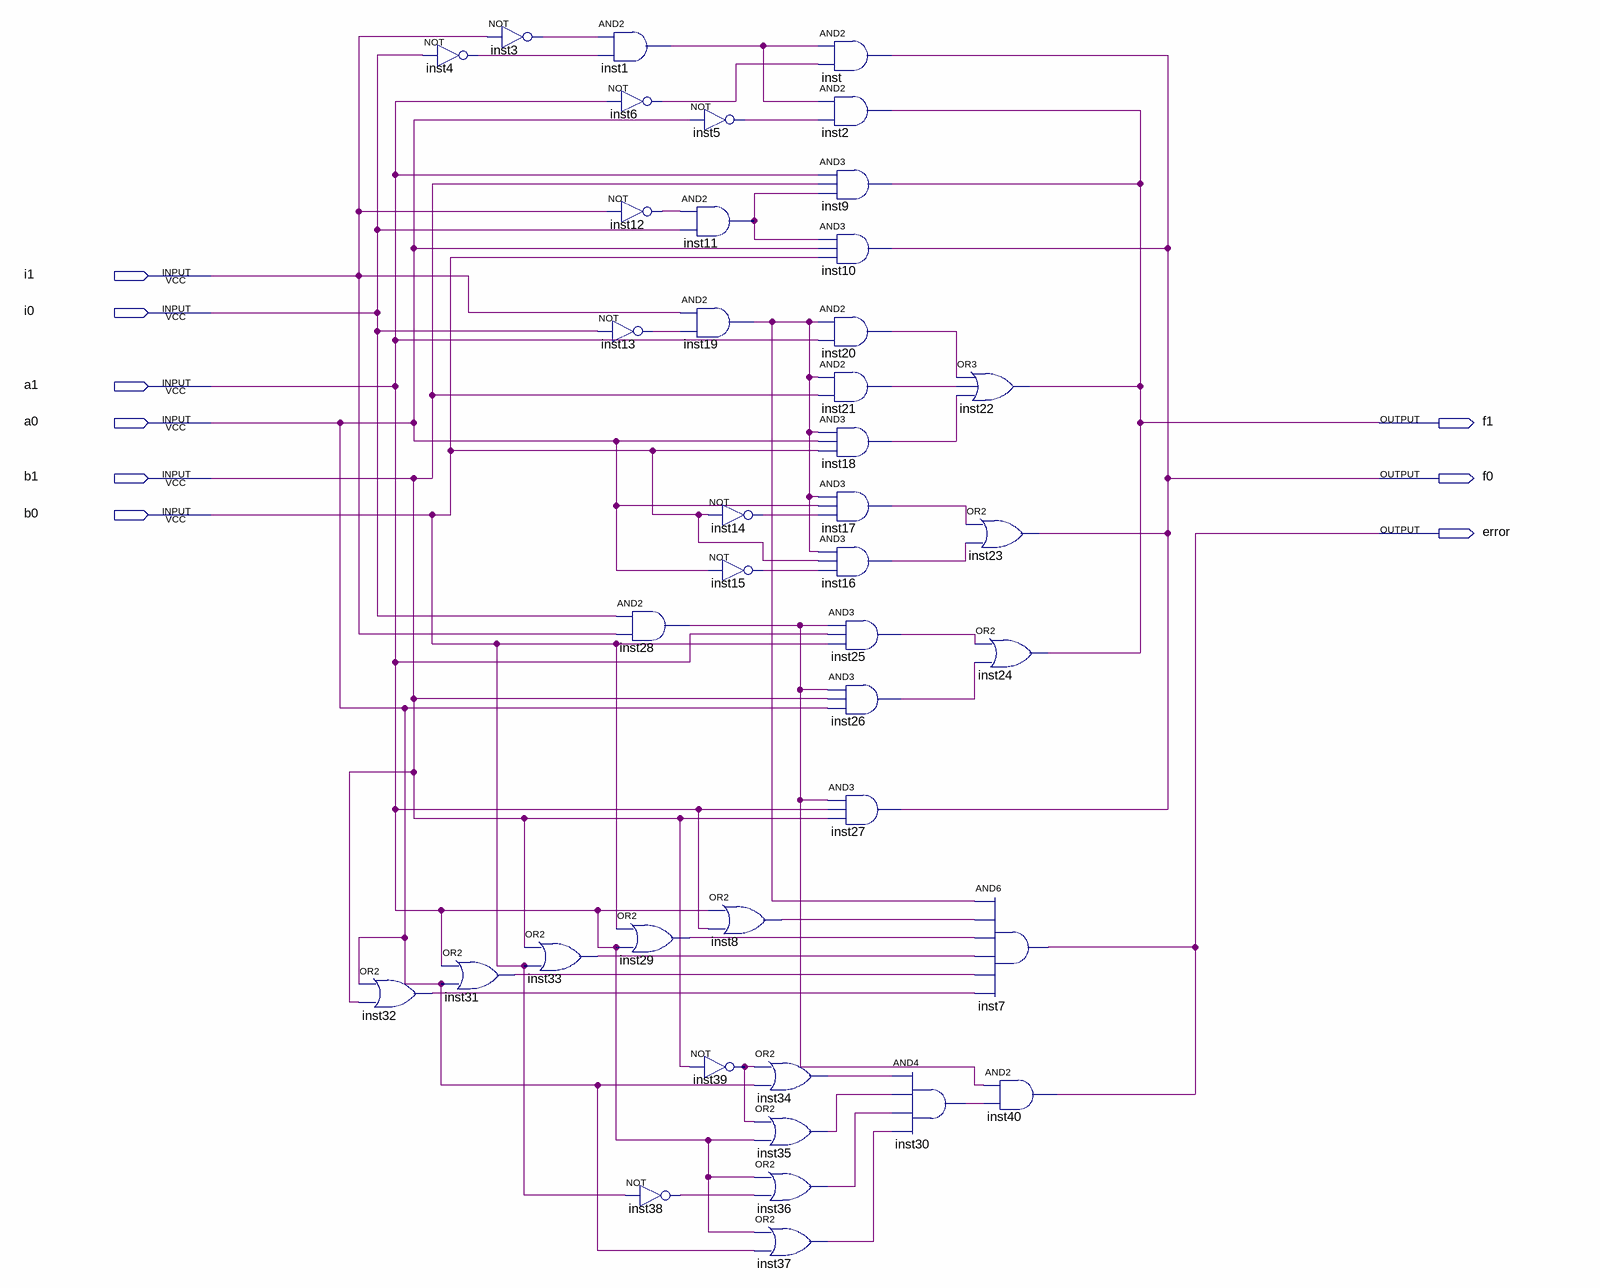
[diagram p0: schematic sheet]
// Quartus schematic schematic.bdf as structural Verilog: 41 symbols, 9 pins
module schematic (
  input  i1,
  input  i0,
  input  a1,
  input  a0,
  input  b1,
  input  b0,
  output f1,
  output f0,
  output error
);

  wire inst1_out, inst3_out, inst4_out, inst5_out, inst6_out, inst8_out, inst11_out, inst12_out, inst13_out,
       inst14_out, inst15_out, inst16_out, inst17_out, inst18_out, inst19_out, inst20_out, inst21_out,
       inst25_out, inst26_out, inst28_out, inst29_out, inst30_out, inst31_out, inst32_out, inst33_out,
       inst34_out, inst35_out, inst36_out, inst37_out, inst38_out, inst39_out;

  not inst4 (inst4_out, i0);
  or inst32 (inst32_out, a0, b1);
  not inst3 (inst3_out, i1);
  or inst31 (inst31_out, a1, a0);
  or inst33 (inst33_out, b1, b0);
  and inst1 (inst1_out, inst3_out, inst4_out);
  not inst6 (inst6_out, a1);
  not inst12 (inst12_out, i1);
  not inst13 (inst13_out, i0);
  and inst28 (inst28_out, i0, i1);
  or inst29 (inst29_out, b0, a1);
  not inst38 (inst38_out, b0);
  not inst5 (inst5_out, a0);
  and inst11 (inst11_out, inst12_out, i0);
  and inst19 (inst19_out, i1, inst13_out);
  not inst14 (inst14_out, b0);
  not inst15 (inst15_out, a0);
  or inst8 (inst8_out, a1, a1);
  not inst39 (inst39_out, b1);
  or inst34 (inst34_out, inst39_out, a0);
  or inst35 (inst35_out, inst39_out, a1);
  or inst36 (inst36_out, a1, inst38_out);
  or inst37 (inst37_out, a1, a0);
  and inst (f0, inst1_out, inst6_out);
  and inst2 (f1, inst1_out, inst5_out);
  and inst9 (f1, a1, b1, inst11_out);
  and inst10 (f0, inst11_out, a0, b0);
  and inst20 (inst20_out, inst19_out, a1);
  and inst21 (inst21_out, inst19_out, b1);
  and inst18 (inst18_out, inst19_out, a0, b0);
  and inst17 (inst17_out, inst19_out, a0, inst14_out);
  and inst16 (inst16_out, inst19_out, b0, inst15_out);
  and inst25 (inst25_out, inst28_out, a1, b0);
  and inst26 (inst26_out, inst28_out, b1, a0);
  and inst27 (f0, inst28_out, a1, b1);
  and inst30 (inst30_out, inst34_out, inst35_out, inst36_out, inst37_out);
  or inst22 (f1, inst20_out, inst21_out, inst18_out);
  or inst23 (f0, inst17_out, inst16_out);
  or inst24 (f1, inst25_out, inst26_out);
  and inst7 (error, inst19_out, inst8_out, inst29_out, inst33_out, inst31_out, inst32_out);
  and inst40 (error, inst28_out, inst30_out);
endmodule
